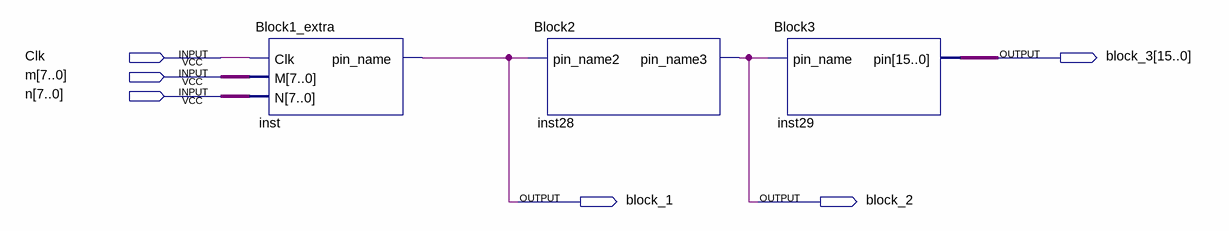
[diagram p0: schematic sheet]
// Quartus schematic silfo_lab2.bdf as structural Verilog: 3 symbols, 6 pins
module silfo_lab2 (
  input  Clk,
  input  [7:0] m,
  input  [7:0] n,
  output [15:0] block_3,
  output block_1,
  output block_2
);

  Block1_extra inst (.Clk(Clk), .M(m), .N(n), .pin_name(block_1));
  Block2 inst28 (.pin_name2(block_1), .pin_name3(block_2));
  Block3 inst29 (.pin_name(block_2), .pin(block_3));
endmodule
